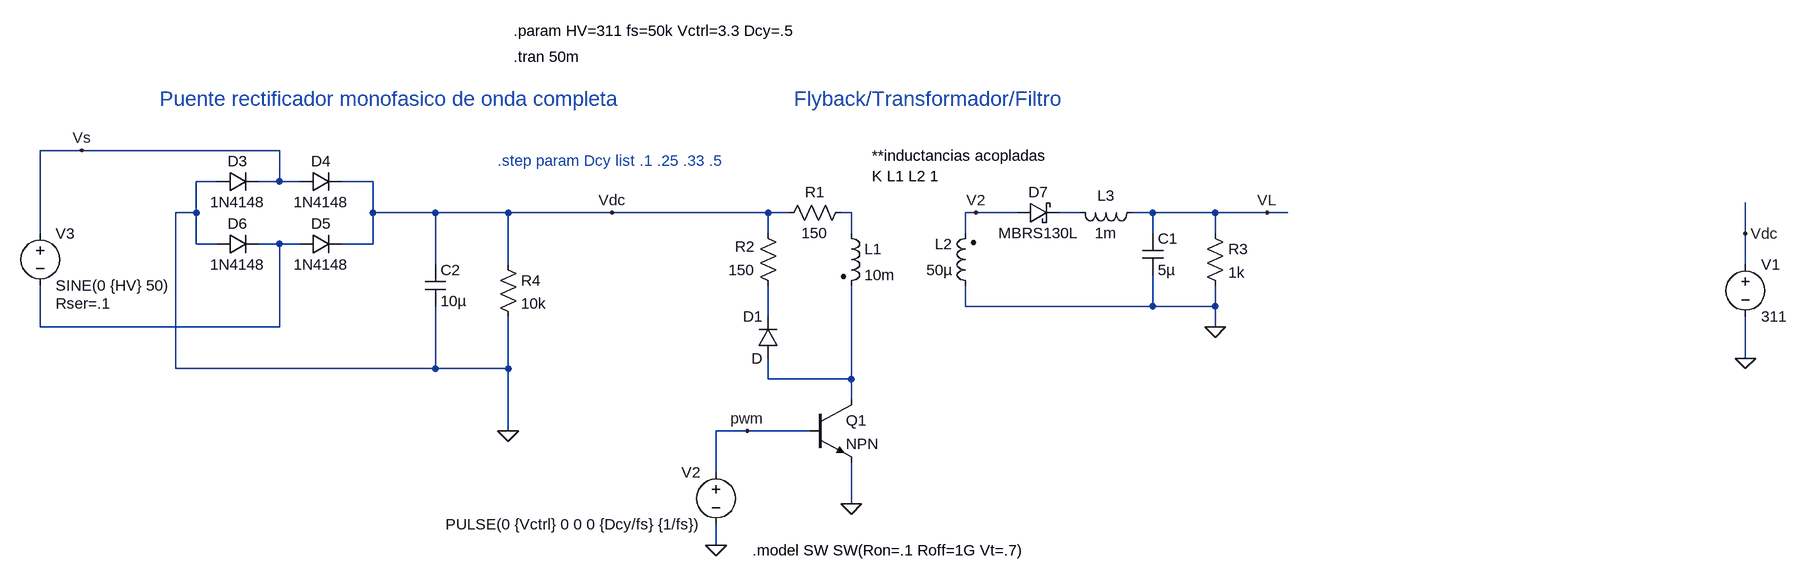
[diagram p0: schematic Draft2.asc]
Draft2.asc, the LTspice schematic file:
Version 4
SHEET 1 1384 712
WIRE -1248 64 -1312 64
WIRE -944 64 -1248 64
WIRE -1040 112 -1072 112
WIRE -944 112 -944 64
WIRE -944 112 -976 112
WIRE -912 112 -944 112
WIRE -800 112 -848 112
WIRE -1072 160 -1072 112
WIRE -1072 160 -1104 160
WIRE -800 160 -800 112
WIRE -704 160 -800 160
WIRE -592 160 -704 160
WIRE -432 160 -592 160
WIRE -192 160 -432 160
WIRE -160 160 -192 160
WIRE -64 160 -80 160
WIRE 128 160 112 160
WIRE 192 160 128 160
WIRE 288 160 256 160
WIRE 400 160 368 160
WIRE 496 160 400 160
WIRE 576 160 496 160
WIRE 608 160 576 160
WIRE -1312 192 -1312 64
WIRE -192 192 -192 160
WIRE -64 192 -64 160
WIRE 112 192 112 160
WIRE 400 192 400 160
WIRE 496 192 496 160
WIRE 1312 192 1312 144
WIRE -1072 208 -1072 160
WIRE -1040 208 -1072 208
WIRE -944 208 -976 208
WIRE -912 208 -944 208
WIRE -800 208 -800 160
WIRE -800 208 -848 208
WIRE -704 240 -704 160
WIRE -592 240 -592 160
WIRE 1312 240 1312 192
WIRE 112 304 112 272
WIRE 400 304 400 256
WIRE 400 304 112 304
WIRE 496 304 496 272
WIRE 496 304 400 304
WIRE -192 320 -192 272
WIRE -1312 336 -1312 272
WIRE -944 336 -944 208
WIRE -944 336 -1312 336
WIRE 496 336 496 304
WIRE 1312 384 1312 320
WIRE -1104 400 -1104 160
WIRE -704 400 -704 304
WIRE -704 400 -1104 400
WIRE -592 400 -592 320
WIRE -592 400 -704 400
WIRE -192 416 -192 384
WIRE -64 416 -64 272
WIRE -64 416 -192 416
WIRE -64 448 -64 416
WIRE -592 496 -592 400
WIRE -224 496 -272 496
WIRE -128 496 -224 496
WIRE -272 560 -272 496
WIRE -64 608 -64 544
WIRE -272 672 -272 640
FLAG -64 608 0
FLAG -272 672 0
FLAG 496 336 0
FLAG 128 160 V2
FLAG 576 160 VL
FLAG -224 496 pwm
FLAG -592 496 0
FLAG -432 160 Vdc
FLAG 1312 192 Vdc
FLAG 1312 384 0
FLAG -1248 64 Vs
SYMBOL res -64 144 R90
WINDOW 0 0 56 VBottom 2
WINDOW 3 32 56 VTop 2
SYMATTR InstName R1
SYMATTR Value 150
SYMBOL diode -176 384 R180
WINDOW 0 24 64 Left 2
WINDOW 3 24 0 Left 2
SYMATTR InstName D1
SYMBOL ind2 -80 176 R0
SYMATTR InstName L1
SYMATTR Value 10m
SYMATTR Type ind
SYMBOL res -176 288 R180
WINDOW 0 36 76 Left 2
WINDOW 3 36 40 Left 2
SYMATTR InstName R2
SYMATTR Value 150
SYMBOL ind2 128 288 R180
WINDOW 0 36 80 Left 2
WINDOW 3 36 40 Left 2
SYMATTR InstName L2
SYMATTR Value 50µ
SYMATTR Type ind
SYMBOL voltage -272 544 M0
WINDOW 123 0 0 Left 0
WINDOW 39 0 0 Left 0
SYMATTR InstName V2
SYMATTR Value PULSE(0 {Vctrl} 0 0 0 {Dcy/fs} {1/fs})
SYMBOL cap 384 192 R0
SYMATTR InstName C1
SYMATTR Value 5µ
SYMBOL res 480 176 R0
SYMATTR InstName R3
SYMATTR Value 1k
SYMBOL voltage -1312 176 R0
WINDOW 123 0 0 Left 0
WINDOW 39 24 124 Left 2
SYMATTR SpiceLine Rser=.1
SYMATTR InstName V3
SYMATTR Value SINE(0 {HV} 50)
SYMBOL res -608 224 R0
SYMATTR InstName R4
SYMATTR Value 10k
SYMBOL diode -1040 128 R270
WINDOW 0 32 32 VTop 2
WINDOW 3 0 32 VBottom 2
SYMATTR InstName D3
SYMATTR Value 1N4148
SYMBOL cap -720 240 R0
SYMATTR InstName C2
SYMATTR Value 10µ
SYMBOL diode -912 128 R270
WINDOW 0 32 32 VTop 2
WINDOW 3 0 32 VBottom 2
SYMATTR InstName D4
SYMATTR Value 1N4148
SYMBOL diode -912 224 R270
WINDOW 0 32 32 VTop 2
WINDOW 3 0 32 VBottom 2
SYMATTR InstName D5
SYMATTR Value 1N4148
SYMBOL diode -1040 224 R270
WINDOW 0 32 32 VTop 2
WINDOW 3 0 32 VBottom 2
SYMATTR InstName D6
SYMATTR Value 1N4148
SYMBOL voltage 1312 224 R0
WINDOW 123 0 0 Left 0
WINDOW 39 0 0 Left 0
SYMATTR InstName V1
SYMATTR Value 311
SYMBOL ind 384 144 R90
WINDOW 0 5 56 VBottom 2
WINDOW 3 32 56 VTop 2
SYMATTR InstName L3
SYMATTR Value 1m
SYMBOL schottky 192 176 R270
WINDOW 0 32 32 VTop 2
WINDOW 3 0 32 VBottom 2
SYMATTR InstName D7
SYMATTR Value MBRS130L
SYMBOL npn -128 448 R0
SYMATTR InstName Q1
TEXT -32 72 Left 2 !**inductancias acopladas\nK L1 L2 1
TEXT -584 -120 Left 2 !.param HV=311 fs=50k Vctrl=3.3 Dcy=.5
TEXT -216 680 Left 2 !.model SW SW(Ron=.1 Roff=1G Vt=.7)
TEXT -584 -80 Left 2 !.tran 50m
TEXT -1128 -16 Left 3 ;Puente rectificador monofasico de onda completa
TEXT -152 -16 Left 3 ;Flyback/Transformador/Filtro
TEXT -608 80 Left 2 ;.step param Dcy list .1 .25 .33 .5

The netlist it stands for:
* Draft2.asc
R1 N001 Vdc 150
D1 N005 N004 D
L1 N001 N005 10m
R2 N004 Vdc 150
L2 0 V2 50µ
V2 pwm 0 PULSE(0 {Vctrl} 0 0 0 {Dcy/fs} {1/fs})
C1 VL 0 5µ
R3 VL 0 1k
V3 Vs N003 SINE(0 {HV} 50) Rser=.1
R4 Vdc 0 10k
D3 0 Vs 1N4148
C2 Vdc 0 10µ
D4 Vs Vdc 1N4148
D5 N003 Vdc 1N4148
D6 0 N003 1N4148
V1 Vdc 0 311
L3 VL N002 1m
D7 V2 N002 MBRS130L
Q1 N005 pwm 0 0 NPN
.model D D
.lib standard.dio
.model NPN NPN
.model PNP PNP
.lib standard.bjt
**inductancias acopladas
K L1 L2 1
.param HV=311 fs=50k Vctrl=3.3 Dcy=.5
.model SW SW(Ron=.1 Roff=1G Vt=.7)
.tran 50m
* Puente rectificador monofasico de onda completa
* Flyback/Transformador/Filtro
* .step param Dcy list .1 .25 .33 .5
.backanno
.end